# EAGLE design Robot_Psoc (EAGLE 7.6.0)
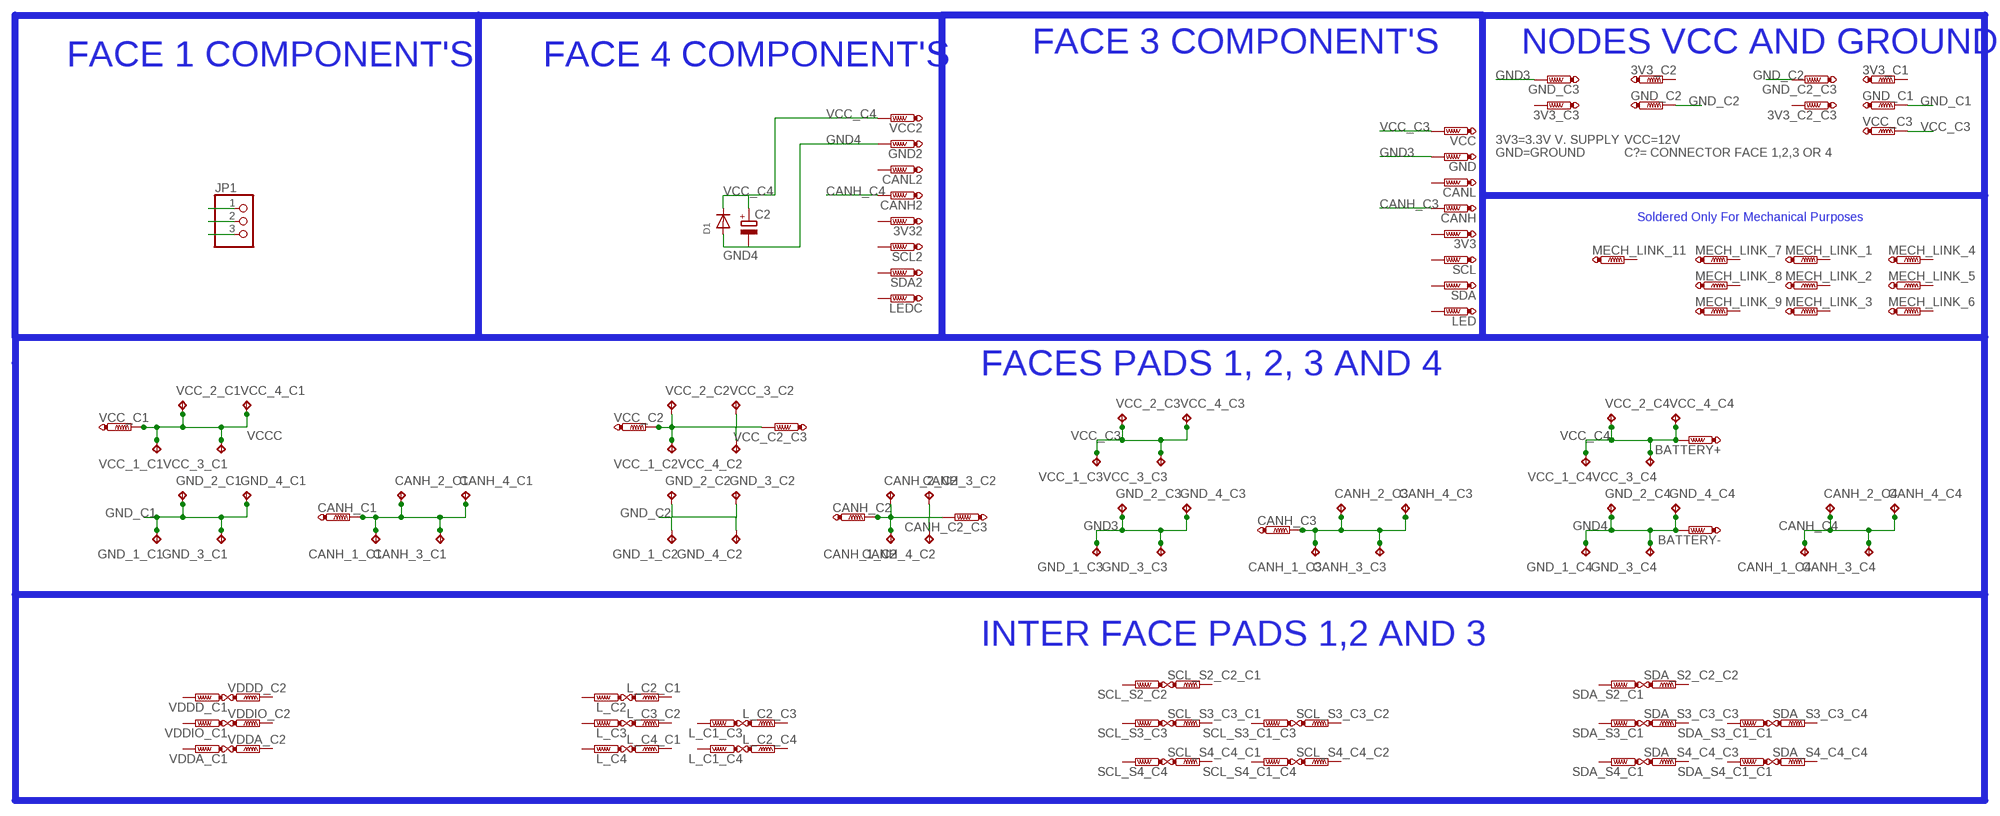
[diagram p0: schematic, sheet 1]

## Parts
3V3  PTR1TP11R  [TP11R]
3V3_C1  PTR1TP11R  [TP11R]
3V3_C2  PTR1TP11R  [TP11R]
3V3_C2_C3  PTR1TP11R  [TP11R]
3V3_C3  PTR1TP11R  [TP11R]
3V32  PTR1TP11R  [TP11R]
BATTERY+  PTR1TP11R  [TP11R]
BATTERY-  PTR1TP11R  [TP11R]
C2  CPOL-EUUD-8X10  [UD-8X10_NICHICON]
CANH  PTR1TP11R  [TP11R]
CANH2  PTR1TP11R  [TP11R]
CANH_1_C1  TPB2,54  [B2,54]
CANH_1_C2  TPB2,54  [B2,54]
CANH_1_C3  TPB2,54  [B2,54]
CANH_1_C4  TPB2,54  [B2,54]
CANH_2_C1  TPB2,54  [B2,54]
CANH_2_C2  TPB2,54  [B2,54]
CANH_2_C3  TPB2,54  [B2,54]
CANH_2_C4  TPB2,54  [B2,54]
CANH_3_C1  TPB2,54  [B2,54]
CANH_3_C2  TPB2,54  [B2,54]
CANH_3_C3  TPB2,54  [B2,54]
CANH_3_C4  TPB2,54  [B2,54]
CANH_4_C1  TPB2,54  [B2,54]
CANH_4_C2  TPB2,54  [B2,54]
CANH_4_C3  TPB2,54  [B2,54]
CANH_4_C4  TPB2,54  [B2,54]
CANH_C1  PTR1TP11R  [TP11R]
CANH_C2  PTR1TP11R  [TP11R]
CANH_C2_C3  PTR1TP11R  [TP11R]
CANH_C3  PTR1TP11R  [TP11R]
CANL  PTR1TP11R  [TP11R]
CANL2  PTR1TP11R  [TP11R]
D1  DIODESMA  [SMADIODE]
GND  PTR1TP11R  [TP11R]
GND2  PTR1TP11R  [TP11R]
GND_1_C1  TPB2,54  [B2,54]
GND_1_C2  TPB2,54  [B2,54]
GND_1_C3  TPB2,54  [B2,54]
GND_1_C4  TPB2,54  [B2,54]
GND_2_C1  TPB2,54  [B2,54]
GND_2_C2  TPB2,54  [B2,54]
GND_2_C3  TPB2,54  [B2,54]
GND_2_C4  TPB2,54  [B2,54]
GND_3_C1  TPB2,54  [B2,54]
GND_3_C2  TPB2,54  [B2,54]
GND_3_C3  TPB2,54  [B2,54]
GND_3_C4  TPB2,54  [B2,54]
GND_4_C1  TPB2,54  [B2,54]
GND_4_C2  TPB2,54  [B2,54]
GND_4_C3  TPB2,54  [B2,54]
GND_4_C4  TPB2,54  [B2,54]
GND_C1  PTR1TP11R  [TP11R]
GND_C2  PTR1TP11R  [TP11R]
GND_C2_C3  PTR1TP11R  [TP11R]
GND_C3  PTR1TP11R  [TP11R]
JP1  PINHD-1X3  [1X03]
L_C1_C3  PTR1TP11R  [TP11R]
L_C1_C4  PTR1TP11R  [TP11R]
L_C2  PTR1TP11R  [TP11R]
L_C2_C1  PTR1TP11R  [TP11R]
L_C2_C3  PTR1TP11R  [TP11R]
L_C2_C4  PTR1TP11R  [TP11R]
L_C3  PTR1TP11R  [TP11R]
L_C3_C2  PTR1TP11R  [TP11R]
L_C4  PTR1TP11R  [TP11R]
L_C4_C1  PTR1TP11R  [TP11R]
LED  PTR1TP11R  [TP11R]
LEDC  PTR1TP11R  [TP11R]
MECH_LINK_1  PTR1TP11R  [TP11R]
MECH_LINK_2  PTR1TP11R  [TP11R]
MECH_LINK_3  PTR1TP11R  [TP11R]
MECH_LINK_4  PTR1TP11R  [TP11R]
MECH_LINK_5  PTR1TP11R  [TP11R]
MECH_LINK_6  PTR1TP11R  [TP11R]
MECH_LINK_7  PTR1TP11R  [TP11R]
MECH_LINK_8  PTR1TP11R  [TP11R]
MECH_LINK_9  PTR1TP11R  [TP11R]
MECH_LINK_11  PTR1TP11R  [TP11R]
SCL  PTR1TP11R  [TP11R]
SCL2  PTR1TP11R  [TP11R]
SCL_S2_C2  PTR1TP11R  [TP11R]
SCL_S2_C2_C1  PTR1TP11R  [TP11R]
SCL_S3_C1_C3  PTR1TP11R  [TP11R]
SCL_S3_C3  PTR1TP11R  [TP11R]
SCL_S3_C3_C1  PTR1TP11R  [TP11R]
SCL_S3_C3_C2  PTR1TP11R  [TP11R]
SCL_S4_C1_C4  PTR1TP11R  [TP11R]
SCL_S4_C4  PTR1TP11R  [TP11R]
SCL_S4_C4_C1  PTR1TP11R  [TP11R]
SCL_S4_C4_C2  PTR1TP11R  [TP11R]
SDA  PTR1TP11R  [TP11R]
SDA2  PTR1TP11R  [TP11R]
SDA_S2_C1  PTR1TP11R  [TP11R]
SDA_S2_C2_C2  PTR1TP11R  [TP11R]
SDA_S3_C1  PTR1TP11R  [TP11R]
SDA_S3_C1_C1  PTR1TP11R  [TP11R]
SDA_S3_C3_C3  PTR1TP11R  [TP11R]
SDA_S3_C3_C4  PTR1TP11R  [TP11R]
SDA_S4_C1  PTR1TP11R  [TP11R]
SDA_S4_C1_C1  PTR1TP11R  [TP11R]
SDA_S4_C4_C3  PTR1TP11R  [TP11R]
SDA_S4_C4_C4  PTR1TP11R  [TP11R]
VCC  PTR1TP11R  [TP11R]
VCC2  PTR1TP11R  [TP11R]
VCC_1_C1  TPB2,54  [B2,54]
VCC_1_C2  TPB2,54  [B2,54]
VCC_1_C3  TPB2,54  [B2,54]
VCC_1_C4  TPB2,54  [B2,54]
VCC_2_C1  TPB2,54  [B2,54]
VCC_2_C2  TPB2,54  [B2,54]
VCC_2_C3  TPB2,54  [B2,54]
VCC_2_C4  TPB2,54  [B2,54]
VCC_3_C1  TPB2,54  [B2,54]
VCC_3_C2  TPB2,54  [B2,54]
VCC_3_C3  TPB2,54  [B2,54]
VCC_3_C4  TPB2,54  [B2,54]
VCC_4_C1  TPB2,54  [B2,54]
VCC_4_C2  TPB2,54  [B2,54]
VCC_4_C3  TPB2,54  [B2,54]
VCC_4_C4  TPB2,54  [B2,54]
VCC_C1  PTR1TP11R  [TP11R]
VCC_C2  PTR1TP11R  [TP11R]
VCC_C2_C3  PTR1TP11R  [TP11R]
VCC_C3  PTR1TP11R  [TP11R]
VDDA_C1  PTR1TP11R  [TP11R]
VDDA_C2  PTR1TP11R  [TP11R]
VDDD_C1  PTR1TP11R  [TP11R]
VDDD_C2  PTR1TP11R  [TP11R]
VDDIO_C1  PTR1TP11R  [TP11R]
VDDIO_C2  PTR1TP11R  [TP11R]

## Nets
CANH: CANH_1_C1.TP CANH_2_C1.TP CANH_3_C1.TP CANH_4_C1.TP CANH_C1.TP JP1.3
CANH_C3: CANH.TP CANH_1_C3.TP CANH_2_C3.TP CANH_3_C3.TP CANH_4_C3.TP CANH_C3.TP
CANH_C4: CANH2.TP CANH_1_C4.TP CANH_2_C4.TP CANH_3_C4.TP CANH_4_C4.TP
GND3: GND.TP GND_1_C3.TP GND_2_C3.TP GND_3_C3.TP GND_4_C3.TP GND_C3.TP
GND4: BATTERY-.TP C2.- D1.A GND2.TP GND_1_C4.TP GND_2_C4.TP GND_3_C4.TP GND_4_C4.TP
GND_C1: GND_1_C1.TP GND_2_C1.TP GND_3_C1.TP GND_4_C1.TP GND_C1.TP JP1.2
GND_C2: GND_1_C2.TP GND_2_C2.TP GND_3_C2.TP GND_4_C2.TP GND_C2.TP GND_C2_C3.TP
N$7: CANH_1_C2.TP CANH_2_C2.TP CANH_3_C2.TP CANH_4_C2.TP CANH_C2.TP CANH_C2_C3.TP
VCC_C2: VCC_1_C2.TP VCC_2_C2.TP VCC_3_C2.TP VCC_4_C2.TP VCC_C2.TP VCC_C2_C3.TP
VCC_C3: VCC.TP VCC_1_C3.TP VCC_2_C3.TP VCC_3_C3.TP VCC_4_C3.TP VCC_C3.TP
VCC_C4: BATTERY+.TP C2.+ D1.C VCC2.TP VCC_1_C4.TP VCC_2_C4.TP VCC_3_C4.TP VCC_4_C4.TP
VCCC: JP1.1 VCC_1_C1.TP VCC_2_C1.TP VCC_3_C1.TP VCC_4_C1.TP VCC_C1.TP
Unconnected: 3V3.TP 3V3_C1.TP 3V3_C2.TP 3V3_C2_C3.TP 3V3_C3.TP 3V32.TP CANL2.TP CANL.TP L_C1_C3.TP L_C1_C4.TP L_C2.TP L_C2_C1.TP L_C2_C3.TP L_C2_C4.TP L_C3.TP L_C3_C2.TP L_C4.TP L_C4_C1.TP LED.TP LEDC.TP MECH_LINK_1.TP MECH_LINK_2.TP MECH_LINK_3.TP MECH_LINK_4.TP MECH_LINK_5.TP MECH_LINK_6.TP MECH_LINK_7.TP MECH_LINK_8.TP MECH_LINK_9.TP MECH_LINK_11.TP SCL2.TP SCL.TP SCL_S2_C2.TP SCL_S2_C2_C1.TP SCL_S3_C1_C3.TP SCL_S3_C3.TP SCL_S3_C3_C1.TP SCL_S3_C3_C2.TP SCL_S4_C1_C4.TP SCL_S4_C4.TP SCL_S4_C4_C1.TP SCL_S4_C4_C2.TP SDA2.TP SDA.TP SDA_S2_C1.TP SDA_S2_C2_C2.TP SDA_S3_C1.TP SDA_S3_C1_C1.TP SDA_S3_C3_C3.TP SDA_S3_C3_C4.TP SDA_S4_C1.TP SDA_S4_C1_C1.TP SDA_S4_C4_C3.TP SDA_S4_C4_C4.TP VDDA_C1.TP VDDA_C2.TP VDDD_C1.TP VDDD_C2.TP VDDIO_C1.TP VDDIO_C2.TP

## Notes on the sheet
- FACE 3 COMPONENT'S | NODES VCC AND GROUND
- FACE 1 COMPONENT'S | FACE 4 COMPONENT'S
- 3V3=3.3V V. SUPPLY | VCC=12V
- GND=GROUND | C?= CONNECTOR FACE 1,2,3 OR 4
- Soldered Only For Mechanical Purposes
- FACES PADS 1, 2, 3 AND 4
- INTER FACE PADS 1,2 AND 3

## Library data of the parts
3V3 3V3_C1 3V3_C2 3V3_C2_C3 3V3_C3 3V32 BATTERY+ BATTERY- CANH CANH2 CANH_C1 CANH_C2 CANH_C2_C3 CANH_C3 CANL CANL2 GND GND2 GND_C1 GND_C2 GND_C2_C3 GND_C3 L_C1_C3 L_C1_C4 L_C2 L_C2_C1 L_C2_C3 L_C2_C4 L_C3 L_C3_C2 L_C4 L_C4_C1 LED LEDC MECH_LINK_1-MECH_LINK_9 MECH_LINK_11 SCL SCL2 SCL_S2_C2 SCL_S2_C2_C1 SCL_S3_C1_C3 SCL_S3_C3 SCL_S3_C3_C1 SCL_S3_C3_C2 SCL_S4_C1_C4 SCL_S4_C4 SCL_S4_C4_C1 SCL_S4_C4_C2 SDA SDA2 SDA_S2_C1 SDA_S2_C2_C2 SDA_S3_C1 SDA_S3_C1_C1 SDA_S3_C3_C3 SDA_S3_C3_C4 SDA_S4_C1 SDA_S4_C1_C1 SDA_S4_C4_C3 SDA_S4_C4_C4 VCC VCC2 VCC_C1 VCC_C2 VCC_C2_C3 VCC_C3 VDDA_C1 VDDA_C2 VDDD_C1 VDDD_C2 VDDIO_C1 VDDIO_C2 = testpad:PTR1: TEST PIN
C2 = rcl:CPOL-EU: POLARIZED CAPACITOR, European symbol
CANH_1_C1-CANH_1_C4 CANH_2_C1-CANH_2_C4 CANH_3_C1-CANH_3_C4 CANH_4_C1-CANH_4_C4 GND_1_C1-GND_1_C4 GND_2_C1-GND_2_C4 GND_3_C1-GND_3_C4 GND_4_C1-GND_4_C4 VCC_1_C1-VCC_1_C4 VCC_2_C1-VCC_2_C4 VCC_3_C1-VCC_3_C4 VCC_4_C1-VCC_4_C4 = testpad:TP: Test pad
D1 = adafruit:DIODE: Diode SMADIODE - SMA Surface Mount Package 20V 1A Schottky Diode Digikey: 641-1014-6-ND DO-1N4148 - Through Hole Small Current Diode SOD-123 20V 1 A (.5mV Vf) Schottky Diode - Digikey: MBRX120TPMSCT-ND SOD-323 10V 570mA (.38mV Vf, 3ns) Schottky Diode - Digikey: ZLLS410CT-ND SOD-523 30V 30mA Schottky Diode (RB751S-40TE61) - Digikey: RB751S-40TE61CT-ND SOT23-R/W - SOT23 Package (R = Solder Paste/Reflow Ovens, W = Hand-Soldering) BAT54Film 40V 300mA - Digikey: 497-7162-1-ND
JP1 = adafruit:PINHD-1X3: PIN HEADER

## Board
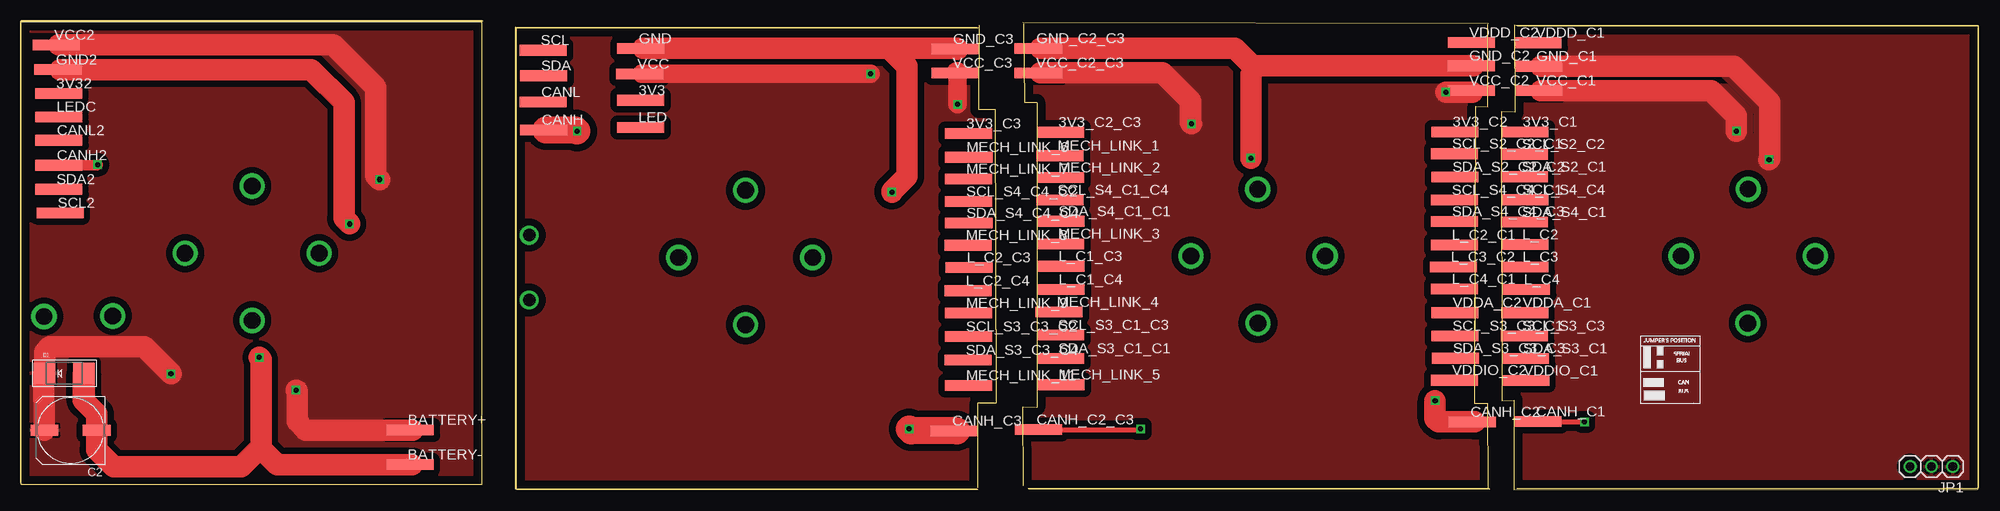
[diagram p1: board, top side]
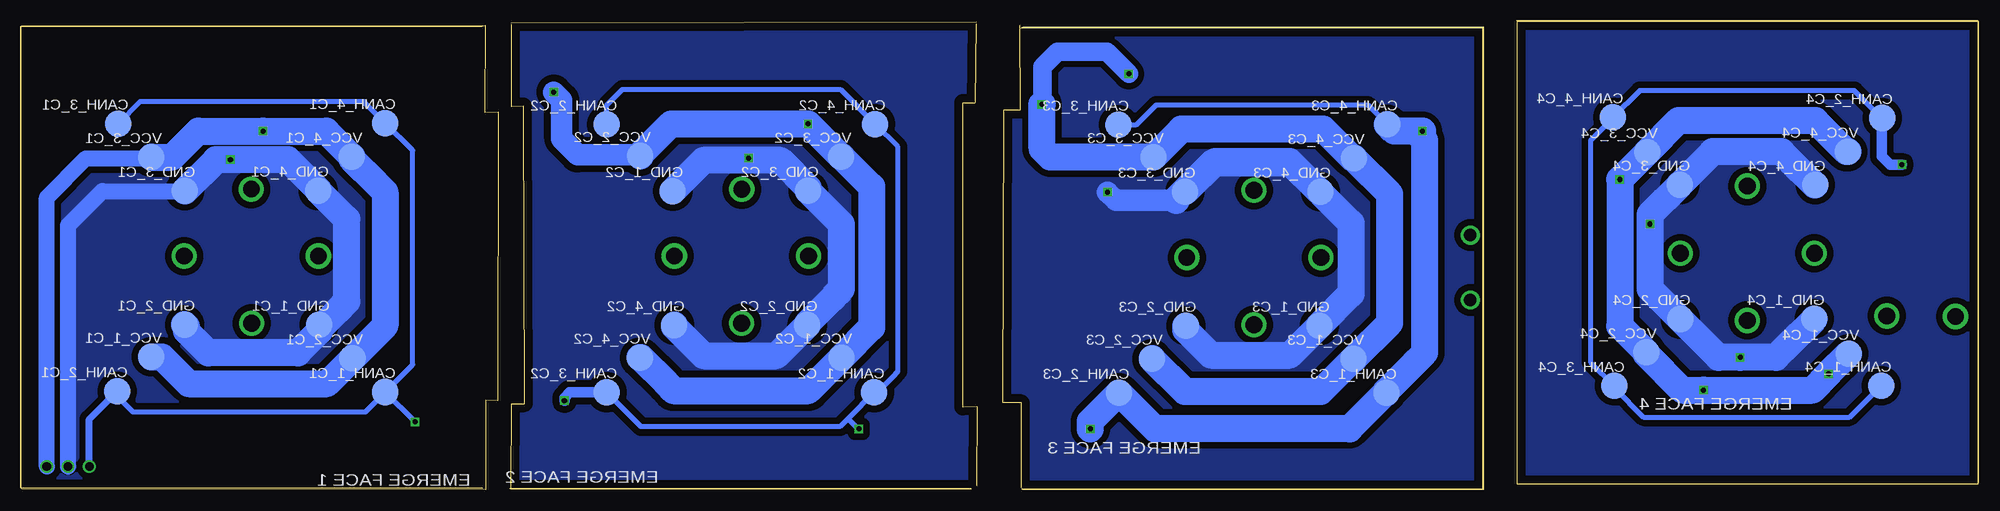
[diagram p2: board, bottom side, seen from below]

Size 233.48 x 55.89 mm. Coordinates in mm from the lower left corner, seen from the top.
Outline: 119.5,55.75 175,55.59
Outline: 114.3,55.35 114.26,45.31 116.23,45.31 116.33,10.37 114.16,10.35 114.14,0.25
Outline: 175.04,0.23 174.93,10.22 173.43,10.25 173.53,45.74 174.93,45.64 174.93,55.5
Outline: 119.59,55.55 119.69,46.11 121.17,46.16 121.17,9.83 119.43,9.91 119.53,0.44
Outline: 233.37,0.04 178.08,0 178.08,10.67 176.63,10.62 176.58,45.07 178.18,44.97 178.11,55.35 233.42,55.29
Outline: 0.02,55.62 0.02,0.62 55.02,0.62 55.02,55.62
Outline: 113.97,55.15 58.97,55.15 58.97,0.15
Outline: 0,55.76 55,55.76
Outline: 55,0.85 55,55.85
Outline: 0,0.85 0,55.85
Outline: 114.34,55 59,55.12 59,0.12
Outline: 233.37,55.33 178.37,55.33
Outline: 178.43,0.16 233.43,0.16 233.43,55.16
Outline: 178.48,55.24 233.48,55.24 233.48,0.24
Outline: 120.19,0.12 175.19,0.12
Outline: 175.08,0.12 120.08,0.12
Outline: 114.12,0.05 59.12,0.05 59.12,55.05 114.12,55.05
Outline: 114.01,0.05 59.01,0.05 59.01,55.05 114.01,55.05
Outline: 0.12,55.89 55.12,55.89
Outline: 55.01,0.89 55.01,55.89 0.01,55.89 0.01,0.89
Copper layers (1*16): Top 0.035mm / dielectric 1.5mm / Bottom 0.035mm
Design rules "default": minimum track width 10mil, minimum drill 24mil, track to track 8mil, track to pad 8mil, pad to pad 8mil, via to via 8mil, smd to smd 8mil, copper to edge 40mil, drill to drill 8mil, minimum pad ring 10mil, minimum via ring 8mil, stop-mask expansion 4mil, vias tented up to drill 0mil, thermal gap 10mil

### Footprints (pad centres in the part's own frame; a part is rotated, then mirrored left to right if it is on the bottom)
TP11R = smd 0.635 x 1.27: P$1 0.381,0; P$2 1.016,0; P$3 -0.254,0; P$4 -0.889,0; P$5 -1.524,0; P$6 1.613,0; P$7 2.21,0; P$8 -2.146,0; P$9 -2.769,0 | smd 1.1 x 1.1: TP 0,0
UD-8X10_NICHICON = smd 3.3 x 1.3: + 3.125,0; - -3.125,0
B2,54 = smd 3.175 x 3.175 bottom: P$1 0,0 | smd 2.54 x 2.54 bottom: TP 0,0
SMADIODE = smd 2.54 x 2.54: A 2.349,0; C -2.349,0
1X03 = drill 1.016: 1 -2.54,0; 2 0,0; 3 2.54,0

### Placement (x,y rotation side)
3V3  74.2,46.43 0 top
3V3_C1  179.65,42.67 0 top
3V3_C2  171.3,42.67 0 top
3V3_C2_C3  124.28,42.61 0 top
3V3_C3  113.3,42.46 0 top
3V32  4.77,47.24 0 top
BATTERY+  46.7,7.11 0 top
BATTERY-  46.68,2.98 0 top
C2  5.92,7.06 180 top
CANH  62.61,42.9 0 top
CANH2  4.79,38.68 0 top
CANH_1_C1  190.04,11.64 0 top
CANH_1_C2  131.73,11.6 0 top
CANH_1_C3  70.64,11.54 0 top
CANH_1_C4  11.62,12.39 0 top
CANH_2_C1  222,11.74 0 top
CANH_2_C2  163.62,43.55 0 top
CANH_2_C3  102.53,11.54 0 top
CANH_2_C4  11.48,44.32 0 top
CANH_3_C1  221.91,43.65 0 top
CANH_3_C2  163.62,11.62 0 top
CANH_3_C3  102.58,43.52 0 top
CANH_3_C4  43.44,12.37 0 top
CANH_4_C1  190.02,43.72 0 top
CANH_4_C2  131.61,43.58 0 top
CANH_4_C3  70.51,43.55 0 top
CANH_4_C4  43.61,44.4 0 top
CANH_C1  181.2,8.12 0 top
CANH_C2  173.4,8.07 0 top
CANH_C2_C3  121.64,7.16 0 top
CANH_C3  111.59,7.02 0 top
CANL  62.58,46.21 0 top
CANL2  4.8,41.66 0 top
D1  5.17,13.87 0 top
GND  74.2,52.6 0 top
GND2  4.69,50.08 0 top
GND_1_C1  197.91,19.66 0 top
GND_1_C2  155.74,35.6 0 top
GND_1_C3  78.64,19.55 0 top
GND_1_C4  19.6,20.36 0 top
GND_2_C1  213.97,19.69 0 top
GND_2_C2  139.71,19.63 0 top
GND_2_C3  94.54,19.54 0 top
GND_2_C4  35.59,20.35 0 top
GND_3_C1  213.94,35.62 0 top
GND_3_C2  139.58,35.63 0 top
GND_3_C3  94.63,35.53 0 top
GND_3_C4  35.64,36.37 0 top
GND_4_C1  198.01,35.66 0 top
GND_4_C2  155.56,19.61 0 top
GND_4_C3  78.5,35.53 0 top
GND_4_C4  19.5,36.34 0 top
GND_C1  181.25,50.49 0 top
GND_C2  173.25,50.54 0 top
GND_C2_C3  121.61,52.62 0 top
GND_C3  111.69,52.54 0 top
JP1  227.86,2.76 180 top
L_C1_C3  124.31,26.64 0 top
L_C1_C4  124.33,23.87 0 top
L_C2  179.62,29.23 0 top
L_C2_C1  171.22,29.18 0 top
L_C2_C3  113.38,26.48 0 top
L_C2_C4  113.25,23.71 0 top
L_C3  179.65,26.56 0 top
L_C3_C2  171.12,26.56 0 top
L_C4  179.83,23.87 0 top
L_C4_C1  171.22,23.92 0 top
LED  74.2,43.2 0 top
LEDC  4.81,44.46 0 top
MECH_LINK_1  124.2,39.82 0 top
MECH_LINK_2  124.28,37.2 0 top
MECH_LINK_3  124.25,29.31 0 top
MECH_LINK_4  124.1,21.18 0 top
MECH_LINK_5  124.31,12.52 0 top
MECH_LINK_6  113.33,39.64 0 top
MECH_LINK_7  113.3,37.05 0 top
MECH_LINK_8  113.25,29.15 0 top
MECH_LINK_9  113.27,21.05 0 top
MECH_LINK_11  113.27,12.43 0 top
SCL  62.55,52.4 0 top
SCL2  4.94,33 0 top
SCL_S2_C2  179.58,40 0 top
SCL_S2_C2_C1  171.24,40.05 0 top
SCL_S3_C1_C3  124.25,18.43 0 top
SCL_S3_C3  179.6,18.33 0 top
SCL_S3_C3_C1  171.3,18.33 0 top
SCL_S3_C3_C2  113.27,18.25 0 top
SCL_S4_C1_C4  124.2,34.54 0 top
SCL_S4_C4  179.63,34.56 0 top
SCL_S4_C4_C1  171.22,34.54 0 top
SCL_S4_C4_C2  113.3,34.35 0 top
SDA  62.6,49.36 0 top
SDA2  4.79,35.82 0 top
SDA_S2_C1  179.58,37.31 0 top
SDA_S2_C2_C2  171.3,37.28 0 top
SDA_S3_C1  179.72,15.64 0 top
SDA_S3_C1_C1  124.28,15.64 0 top
SDA_S3_C3_C3  171.35,15.67 0 top
SDA_S3_C3_C4  113.25,15.46 0 top
SDA_S4_C1  179.61,31.9 0 top
SDA_S4_C1_C1  124.31,32 0 top
SDA_S4_C4_C3  171.24,31.97 0 top
SDA_S4_C4_C4  113.33,31.79 0 top
VCC  74.05,49.57 0 top
VCC2  4.5,53.03 0 top
VCC_1_C1  217.94,15.84 0 top
VCC_1_C2  135.61,15.76 0 top
VCC_1_C3  74.56,15.61 0 top
VCC_1_C4  15.5,16.19 0 top
VCC_2_C1  193.94,15.66 0 top
VCC_2_C2  159.62,39.79 0 top
VCC_2_C3  98.56,15.61 0 top
VCC_2_C4  39.64,16.38 0 top
VCC_3_C1  217.94,39.65 0 top
VCC_3_C2  135.69,39.7 0 top
VCC_3_C3  98.43,39.66 0 top
VCC_3_C4  39.53,40.25 0 top
VCC_4_C1  194.02,39.71 0 top
VCC_4_C2  159.65,15.74 0 top
VCC_4_C3  74.5,39.54 0 top
VCC_4_C4  15.58,40.3 0 top
VCC_C1  181.25,47.59 0 top
VCC_C2  173.28,47.59 0 top
VCC_C2_C3  121.61,49.7 0 top
VCC_C3  111.66,49.69 0 top
VDDA_C1  179.64,21.1 0 top
VDDA_C2  171.3,21.1 0 top
VDDD_C1  181.2,53.28 0 top
VDDD_C2  173.28,53.31 0 top
VDDIO_C1  179.75,13 0 top
VDDIO_C2  171.22,13.05 0 top

### Tracks (layer width: path | path; a pad name or v marks a point on that pad's centre or on a via)
CANH  (via drill 0.6)
  Top 0.61: CANH_C1.TP 186.44,8.12 v186.47,8.09
  Bottom 0.61: CANH_2_C1.TP 222,11.15 220.13,9.28 192.41,9.28 | 192.41,9.28 CANH_1_C1.TP 186.48,8.09 v186.47,8.09 | CANH_3_C1.TP 219.3,46.26 192.59,46.26 190.05,43.72 CANH_4_C1.TP 186.75,40.45 186.75,14.91 192.39,9.28 192.41,9.28
  Bottom 0.813: JP1.3 225.32,8.42 CANH_2_C1.TP
CANH_C3  (via drill 0.6)
  Top 3.2: CANH.TP 66.19,42.9 v66.33,42.76 | CANH_C3.TP 106.16,7.02 v105.93,7.24
  Bottom 0.61: CANH_3_C3.TP 100.42,43.52 98.05,45.89 72.85,45.89 CANH_4_C3.TP
  Bottom 3.2: v66.33,42.76 67.18,42.76 | 67.18,42.76 69.72,42.76 CANH_4_C3.TP | 67.18,42.76 66.05,41.63 66.05,16.33 67.18,15.2 70.64,11.74 CANH_1_C3.TP 70.72,11.54 75.03,7.24 98.22,7.24 CANH_2_C3.TP 105.93,8.13 v105.93,7.24
CANH_C4  (via drill 0.6)
  Top 1.27: CANH2.TP 9.04,38.68 v9.13,38.76
  Bottom 0.61: CANH_2_C4.TP 11.54,44.32 14.81,47.59 40.41,47.59 CANH_4_C4.TP 43.61,44.31 46.29,41.62 46.29,15.21 CANH_3_C4.TP 43.44,12.15 39.96,8.66 15.36,8.66 CANH_1_C4.TP
  Bottom 1.27: v9.13,38.76 10.55,38.76 11.53,39.75 11.53,44.26 CANH_2_C4.TP
GND3  (via drill 0.6)
  Top 2.54: GND.TP 103.51,52.6 | 103.51,52.6 111.62,52.6 GND_C3.TP | v103.87,35.49 103.87,35.58 105.65,37.36 105.65,50.46 103.51,52.6
  Bottom 2.54: 82.17,39.12 91.04,39.12 95.67,34.49 102.87,34.49 v103.87,35.49
  Bottom 3.2: GND_4_C3.TP 78.57,35.53 82.17,39.12 91.04,39.12 GND_3_C3.TP | GND_2_C3.TP 94.54,19.03 91.57,16.05 82.13,16.05 GND_1_C3.TP 74.83,23.35 74.83,31.77 82.03,38.97 91.38,38.97 95.67,34.68 95.67,34.49
  pour Bottom (isolate 0.762): 58.82,0.16 114.31,0.1 113.97,10.34 115.95,10.38 116.05,45.2 114.49,45.31 114.14,55.21 58.69,55.41
GND4  (via drill 0.6)
  Top 2.54: C2.- 9.04,9.04 7.43,10.65 7.43,13.78 D1.A 7.52,10.52 9.02,9.02 9.02,4.75 11.04,2.73 26.24,2.73 28.65,5.14 | GND2.TP 34.63,50.08 38.54,46.17 38.54,32.34 v39.2,31.68 | BATTERY-.TP 30.53,2.98 28.65,4.86 28.65,5.14 | 28.65,5.14 28.65,15.55 v28.43,15.76
  Bottom 3.2: GND_1_C4.TP 19.6,20.33 23.04,16.9 24.17,15.76 v28.43,15.76 31.01,15.76 GND_2_C4.TP 39.2,23.95 v39.2,31.68 39.2,32.81 GND_3_C4.TP | GND_3_C4.TP | GND_4_C4.TP 19.55,36.34 22.75,39.54 23.51,40.3 31.72,40.3 GND_3_C4.TP
  pour Bottom (isolate 0.762): -0.01,0.8 54.92,0.64 55.05,55.35 -0.02,55.41 -0.01,7.88
GND_C1  (via drill 0.6)
  Top 2.54: GND_C1.TP 204.27,50.49 208.59,46.17 208.59,39.46 v208.49,39.37
  Bottom 1.93: JP1.2 227.86,31.51 223.78,35.6 213.96,35.6 GND_3_C1.TP
  Bottom 3.2: GND_2_C1.TP 213.76,19.48 213.76,18.94 211.13,16.31 200.47,16.31 197.91,18.87 GND_1_C1.TP 197.4,19.66 195.77,21.29 194.62,22.44 194.62,32.27 GND_4_C1.TP 198.01,35.76 201.62,39.37 v208.49,39.37 210.19,39.37 GND_3_C1.TP
  pour Top (isolate 0.762): 178.08,55.14 178.18,45.03 176.63,45.13 176.81,10.59 178.16,10.66 177.98,-0.08 233.17,0.1 233.17,55.09
  pour Bottom (isolate 0.762): 177.97,55.14 178.07,45.03 176.52,45.13 176.7,10.59 178.04,10.66 177.87,-0.08 233.06,0.1 233.06,55.09
GND_C2  (via drill 0.6)
  Top 1.27: 146.86,50.53 147.71,50.53 146.67,49.49 | GND_C2.TP
  Top 2.54: GND_C2_C3.TP 144.77,52.62 146.86,50.53 | 147.71,50.53 GND_C2.TP | v146.67,39.54 146.67,49.49
  Bottom 1.27: 142.89,39.26 146.39,39.26 v146.67,39.54
  Bottom 3.2: GND_4_C2.TP 155.56,19.47 152.07,15.98 143.36,15.98 GND_2_C2.TP 139.71,19.77 136.6,22.88 136.6,22.94 135.61,23.92 135.61,31.66 GND_3_C2.TP 139.58,35.94 142.89,39.26 152.09,39.26 GND_1_C2.TP
  pour Bottom (isolate 0.813): 119.56,0.6 174.88,0.24 174.97,10.45 173.16,10.42 173.24,45.9 175.05,45.79 174.97,55.55 119.49,55.52 119.7,46.12 121.2,45.88 121.09,9.99 119.45,9.91
N$6  (via drill 2)
  other vias: 206,35.84
N$7  (via drill 0.6)
  Top 0.61: CANH_C2_C3.TP 133.45,7.16 v133.53,7.24
  Top 2.54: CANH_C2.TP 169.07,8.07 168.67,8.48 v168.67,10.62
  Bottom 0.61: CANH_2_C2.TP 163.62,45.84 161.74,47.72 135.74,47.72 CANH_4_C2.TP 128.89,40.87 128.89,14.09 129.16,13.82 129.16,13.77 131.33,11.6 CANH_1_C2.TP 134.86,8.47 | 134.86,8.47 135.8,7.52 159.52,7.52 CANH_3_C2.TP | v133.53,7.24 133.63,7.24 134.86,8.47
  Bottom 1.27: v168.67,10.62 168.67,10.99 168.03,11.63 CANH_3_C2.TP
N$13  (via drill 1.5)
  other vias: 60.62,30.35
N$19  (via drill 1.5)
  other vias: 60.62,22.61
N$23  (via drill 2 pad 2.18)
  other vias: 213.99,27.86
N$25  (via drill 2 pad 2.18)
  other vias: 197.99,27.86
N$28  (via drill 2 pad 2.18)
  other vias: 205.97,19.86
N$29  (via drill 2)
  other vias: 2.75,20.65
N$30  (via drill 2 pad 2.18)
  other vias: 139.55,27.86
N$31  (via drill 2 pad 2.18)
  other vias: 147.5,35.83
N$33  (via drill 2 pad 2.18)
  other vias: 155.55,27.86
N$34  (via drill 2 pad 2.18)
  other vias: 147.55,19.86
N$35  (via drill 2)
  other vias: 78.43,27.67
N$36  (via drill 2)
  other vias: 86.43,35.7
N$37  (via drill 2)
  other vias: 94.43,27.67
N$38  (via drill 2)
  other vias: 86.43,19.67
N$39  (via drill 2)
  other vias: 19.57,28.2
N$40  (via drill 2)
  other vias: 27.57,36.2
N$41  (via drill 2)
  other vias: 35.57,28.2
N$42  (via drill 2)
  other vias: 27.57,20.18
N$45  (via drill 2)
  other vias: 10.96,20.71
VCC_C2  (via drill 0.6)
  Top 1.27: 173.09,47.4 VCC_C2.TP
  Top 2.54: v169.93,47.4 173.09,47.4 | VCC_C2_C3.TP 136.15,49.7 139.49,46.36 139.49,43.73 v139.6,43.61
  Bottom 2.54: 159.62,39.93 167.09,39.93 168.98,41.81 168.98,46.46 v169.93,47.4
  Bottom 3.2: VCC_4_C2.TP 159.55,15.74 156.5,12.69 156.5,12.64 155.68,11.82 139.55,11.82 VCC_1_C2.TP 132.02,19.35 132.02,36.13 135.59,39.7 VCC_3_C2.TP v139.6,43.61 155.94,43.61 159.62,39.93 VCC_2_C2.TP
  pour Top (isolate 0.813): 119.6,0.62 174.94,0.51 175.12,10.45 172.91,10.42 173.35,45.75 175.03,45.62 175.12,55.56 119.51,55.49 119.76,46.05 121.16,45.97 121.51,9.85 119.43,9.99
VCC_C3  (via drill 0.6)
  Top 2.184: v111.72,45.95 111.72,49.64 | VCC.TP v101.33,49.57
  Top 2.54: 111.72,49.64 VCC_C3.TP
  Bottom 2.184: v101.33,49.57 v101.33,49.58 103.96,52.2 109.86,52.2 111.64,50.43 111.64,46.03 v111.72,45.95
  Bottom 3.2: v111.72,45.95 111.68,45.91 111.68,40.63 110.7,39.66 VCC_3_C3.TP 95.09,43 78.16,43 74.7,39.54 VCC_4_C3.TP 70.22,35.26 70.22,19.86 74.47,15.61 VCC_1_C3.TP 78.46,11.71 94.7,11.71 98.56,15.57 VCC_2_C3.TP
  pour Top (isolate 0.813): 58.95,0.28 114.24,0.05 114.01,10.26 115.9,10.37 116.12,45.1 114.52,45.17 114.27,55.2 58.69,55.31
VCC_C4  (via drill 0.6)
  Top 2.54: C2.+ 2.71,13.8 D1.C 2.82,16.4 3.44,17.02 14.67,17.02 v17.89,13.8 | VCC2.TP 37.26,53.03 42.32,47.97 42.32,37.46 v42.79,36.98 | BATTERY+.TP 33.95,7.11 32.92,8.15 32.92,11.77 v32.81,11.88
  Bottom 3.2: VCC_1_C4.TP v17.89,13.8 19.81,11.88 v32.81,11.88 35.32,11.88 39.64,16.2 VCC_2_C4.TP 42.79,19.53 v42.79,36.98 VCC_3_C4.TP | VCC_3_C4.TP | VCC_4_C4.TP 15.76,40.31 19.44,43.99 35.78,43.99 VCC_3_C4.TP
  pour Top (isolate 0.762): -0.01,0.81 55.02,0.43 55.05,55.26 0.11,55.33 -0.01,7.78
VCCC  (via drill 0.6)
  Top 2.54: VCC_C1.TP 201.58,47.59 204.62,44.56 v204.62,42.76
  Bottom 1.93: JP1.1 230.4,34.84 225.73,39.51 218.08,39.51 VCC_3_C1.TP
  Bottom 3.2: VCC_1_C1.TP 216.68,15.84 213.48,12.64 196.97,12.64 VCC_2_C1.TP 190.06,19.55 190.06,35.47 191.1,36.51 194.02,39.43 VCC_4_C1.TP 197.07,42.76 v204.62,42.76 212.34,42.76 215.44,39.65 VCC_3_C1.TP
  pour Top (isolate 0.762): 178.08,55.14 178.18,45.03 176.63,45.13 176.81,10.59 178.16,10.66 177.98,-0.08 233.17,0.1 233.17,55.09

### Text on the board
bNames: EMERGE FACE 4 | EMERGE FACE 3 | EMERGE FACE 2 | EMERGE FACE 1